# Altium schematic sheet Power.SchDoc
size A4; SheetNumber: 2; SheetTotal: 3
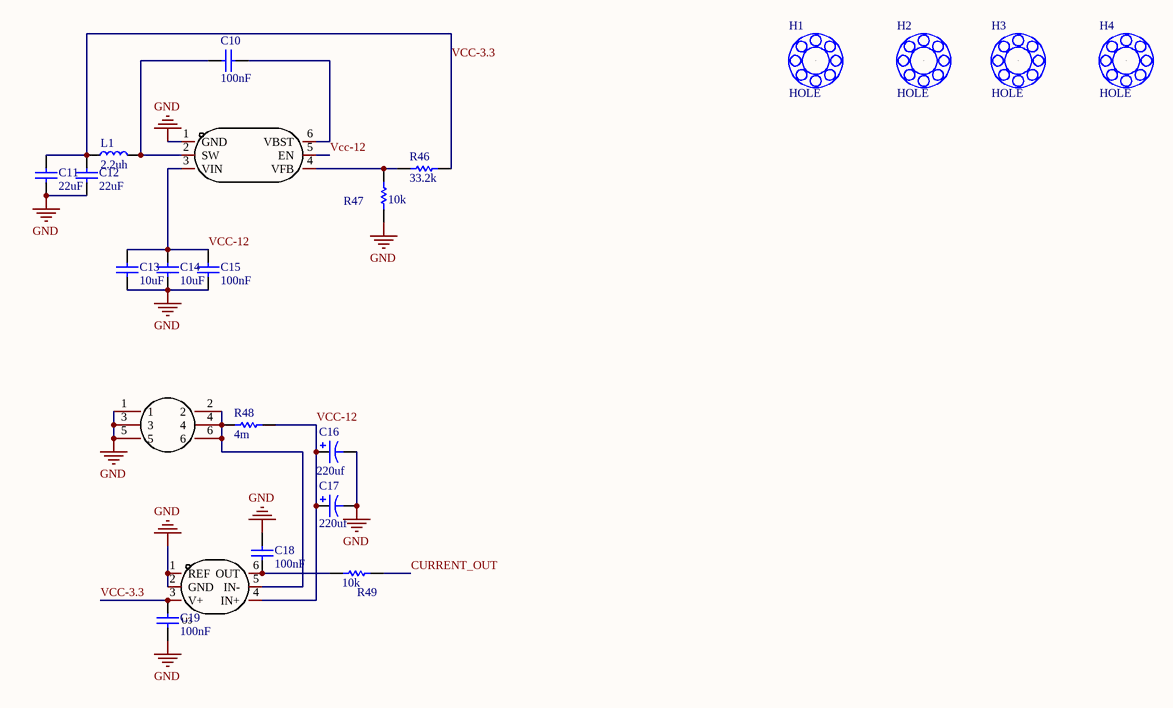
[diagram p0: Power.SchDoc]

## Parts
C10  value 100nF  [C0402]  (hidden comment: CL05B104KB54PNC)
C11  value 22uF  [C0603]  (hidden comment: CL10A226MQ8NRNC)
C12  value 22uF  [C0603]  (hidden comment: CL10A226MQ8NRNC)
C13  value 10uF  [C0402]  (hidden comment: CL05A106MQ5NUNC)
C14  value 10uF  [C0402]  (hidden comment: CL05A106MQ5NUNC)
C15  value 100nF  [C0402]  (hidden comment: CL05B104KB54PNC)
C16  value 220uf  [CAP-SMD_BD6.3-L6.6-W6.6-LS7.4-FD]  (hidden comment: RVT1E221M0607)
C17  value 220uf  [CAP-SMD_BD6.3-L6.6-W6.6-LS7.4-FD]  (hidden comment: RVT1E221M0607)
C18  value 100nF  [C0402]  (hidden comment: CL05B104KB54PNC)
C19  value 100nF  [C0402]  (hidden comment: CL05B104KB54PNC)
H1  HOLE  [HOLE_3.5mm_MUL]
H2  HOLE  [HOLE_3.5mm_MUL]
H3  HOLE  [HOLE_3.5mm_MUL]
H4  HOLE  [HOLE_3.5mm_MUL]
L1  value 2.2uh  [L0603]  (hidden comment: CMI160808U2R2KT)
P11  HC-5557-2*3A  [CONN-TH_HC-5557-2-3A]  (value not drawn)
R46  value 33.2k  [R0402]  (hidden comment: 0402WGF3322TCE)
R47  value 10k  [R0402]  (hidden comment: 0402WGF1002TCE)
R48  value 4m  [R2512]  (hidden comment: FRM252WFR004TN)
R49  value 10k  [R0402]  (hidden comment: 0402WGF1002TCE)
U2  TPS563201DDCR  [SOT-23-6_L2.9-W1.6-P0.95-LS2.8-BL]  (value not drawn)
U3  INA199B2DCKR  [SC-70-6_L2.0-W1.3-P0.65-LS2.1-BR]  (value not drawn)

## Nets
GND: C11.2 C12.2 C13.2 C14.2 C15.1 C16.2 C17.2 C18.2 C19.1 P11.1 P11.3 P11.5 R47.1 U2.1(GND) U3.1(REF) U3.2(GND)
CURRENT_OUT: R49.1
VCC-3.3: C11.1 C12.1 C19.2 L1.1 R46.2 U3.3(V+)
VCC-12: C13.1 C14.1 C15.2 C16.1 C17.1 R48.2 U2.3(VIN) U2.5(EN) U3.4(IN+)
NetC10_1: C10.1 L1.2 U2.2(SW)
NetC10_2: C10.2 U2.6(VBST)
NetC18_1: C18.1 R49.2 U3.6(OUT)
NetP11_2: P11.2 P11.4 P11.6 R48.1 U3.5(IN-)
NetR46_1: R46.1 R47.2 U2.4(VFB)

Not connected (* = marked no-connect by the designer): H1 1; H2 1; H3 1; H4 1

## Library data of the parts
C10 C15 C18 C19 = 100nf: Published: 8-Jun-2000; LatestRevisionDate: 17-Jul-2002; LatestRevisionNote: Re-released for DXP Platform.; PackageReference: 0402; Publisher: Altium Limited; PackageDescription: Radial Cap, Thru-Hole; 2 Leads; 0.3 in Pin Spacing
C11 C12 = 22uf: 0603 基础; Published: 8-Jun-2000; LatestRevisionDate: 17-Jul-2002; LatestRevisionNote: Re-released for DXP Platform.; PackageReference: 0402; Publisher: Altium Limited; PackageDescription: Radial Cap, Thru-Hole; 2 Leads; 0.3 in Pin Spacing
C13 C14 = 10uf: Published: 8-Jun-2000; LatestRevisionDate: 17-Jul-2002; LatestRevisionNote: Re-released for DXP Platform.; PackageReference: 0402; Publisher: Altium Limited; PackageDescription: Radial Cap, Thru-Hole; 2 Leads; 0.3 in Pin Spacing
C16 C17 = Cap电解电容: Polarized Capacitor (Axial); Published: 8-Jun-2000; LatestRevisionDate: 17-Jul-2002; LatestRevisionNote: Re-released for DXP Platform.; PackageReference: POLAR0.8; Publisher: Altium Limited; PackageDescription: Polarized Capacitor; 2 Leads
H1-H4 = HOLE: 固定孔
L1 = inductance_small: 电感; PackageReference: 0402
P11 = HC-5557-2*3A: 6p; Manufacturer: HCTL(华灿天禄); Add into BOM: yes; Pins Structure: 2x3P; Pitch: 4.2mm; Number of PINs Per Row: 3; Current Rating (Max): 9A; Name: HC-5557-2*3A; Symbol: HC-5557-2*3A; Device: HC-5557-2*3A; LCSC Part Name: 2x3P 间距:4.2mm 直插; Supplier Part: C2845778; Manufacturer Part: HC-5557-2*3A; Supplier Footprint: 插件,P=4.2mm; JLCPCB Part Class: Extended Part; Datasheet: https://atta.szlcsc.com/upload/public/pdf/source/20230620/FF5B1F4AE343F4430EEB0EA0134778E8.pdf; Supplier: LCSC; Convert to PCB: yes; Mounting Style: 直插; Reference Series: -; Number of Pins: 6P; Number of Rows: 2; Row Spacing: 4.2mm; Contact Material: 黄铜; Contact Plating: 锡; Operating Temperature Range: -25℃~+85℃
R46-R49 = Res Semi: Semiconductor Resistor; Published: 8-Jun-2000; LatestRevisionDate: 17-Jul-2002; LatestRevisionNote: Re-released for DXP Platform.; PackageReference: 0402; Publisher: Altium Limited; PackageDescription: Axial Device, Thru-Hole; 2 Leads; 0.5 in Pin Spacing
U2 = TPS563201DDCR: Manufacturer: TI(德州仪器); Add into BOM: yes; Function: 降压型; Output Type: 可调; Input Voltage: 4.5V~17V; Output Voltage: 768mV~7V; Output Current (Max): 3A; Switching Frequency: 580kHz; Synchronous Rectification: 是; Number of Outputs: 1; Topology: 降压式; Switch tube (built-in/external): 内置; Name: TPS563201DDCR; Symbol: TPS563201DDCR; Device: TPS563201DDCR; LCSC Part Name: TPS563201DDCR; Supplier Part: C116592; Manufacturer Part: TPS563201DDCR; Supplier Footprint: TSOT-23-6; JLCPCB Part Class: Extended Part; Datasheet: https://atta.szlcsc.com/upload/public/pdf/source/20230424/FEEFD13F14AFA838E4C009B2DDC1DFA0.pdf; Supplier: LCSC; Convert to PCB: yes; Operating Temperature: -40℃~+125℃@(TJ)
U3 = INA199B1DCKR: 电流感应放大器; Manufacturer: TI(德州仪器); Add into BOM: yes; Supply Voltage: -100mV~26V; Supply Current: 65uA; Name: INA199B1DCKR; Symbol: INA199B1DCKR; Device: INA199B1DCKR; LCSC Part Name: INA199B1DCKR; Supplier Part: C398920; Manufacturer Part: INA199B1DCKR; Supplier Footprint: SC-70-6; JLCPCB Part Class: Extended Part; Datasheet: https://www.ti.com/cn/lit/gpn/ina199; Supplier: LCSC; Convert to PCB: yes; Operating Temperature: -40℃~+125℃